# EAGLE design display2 (EAGLE 6.1)
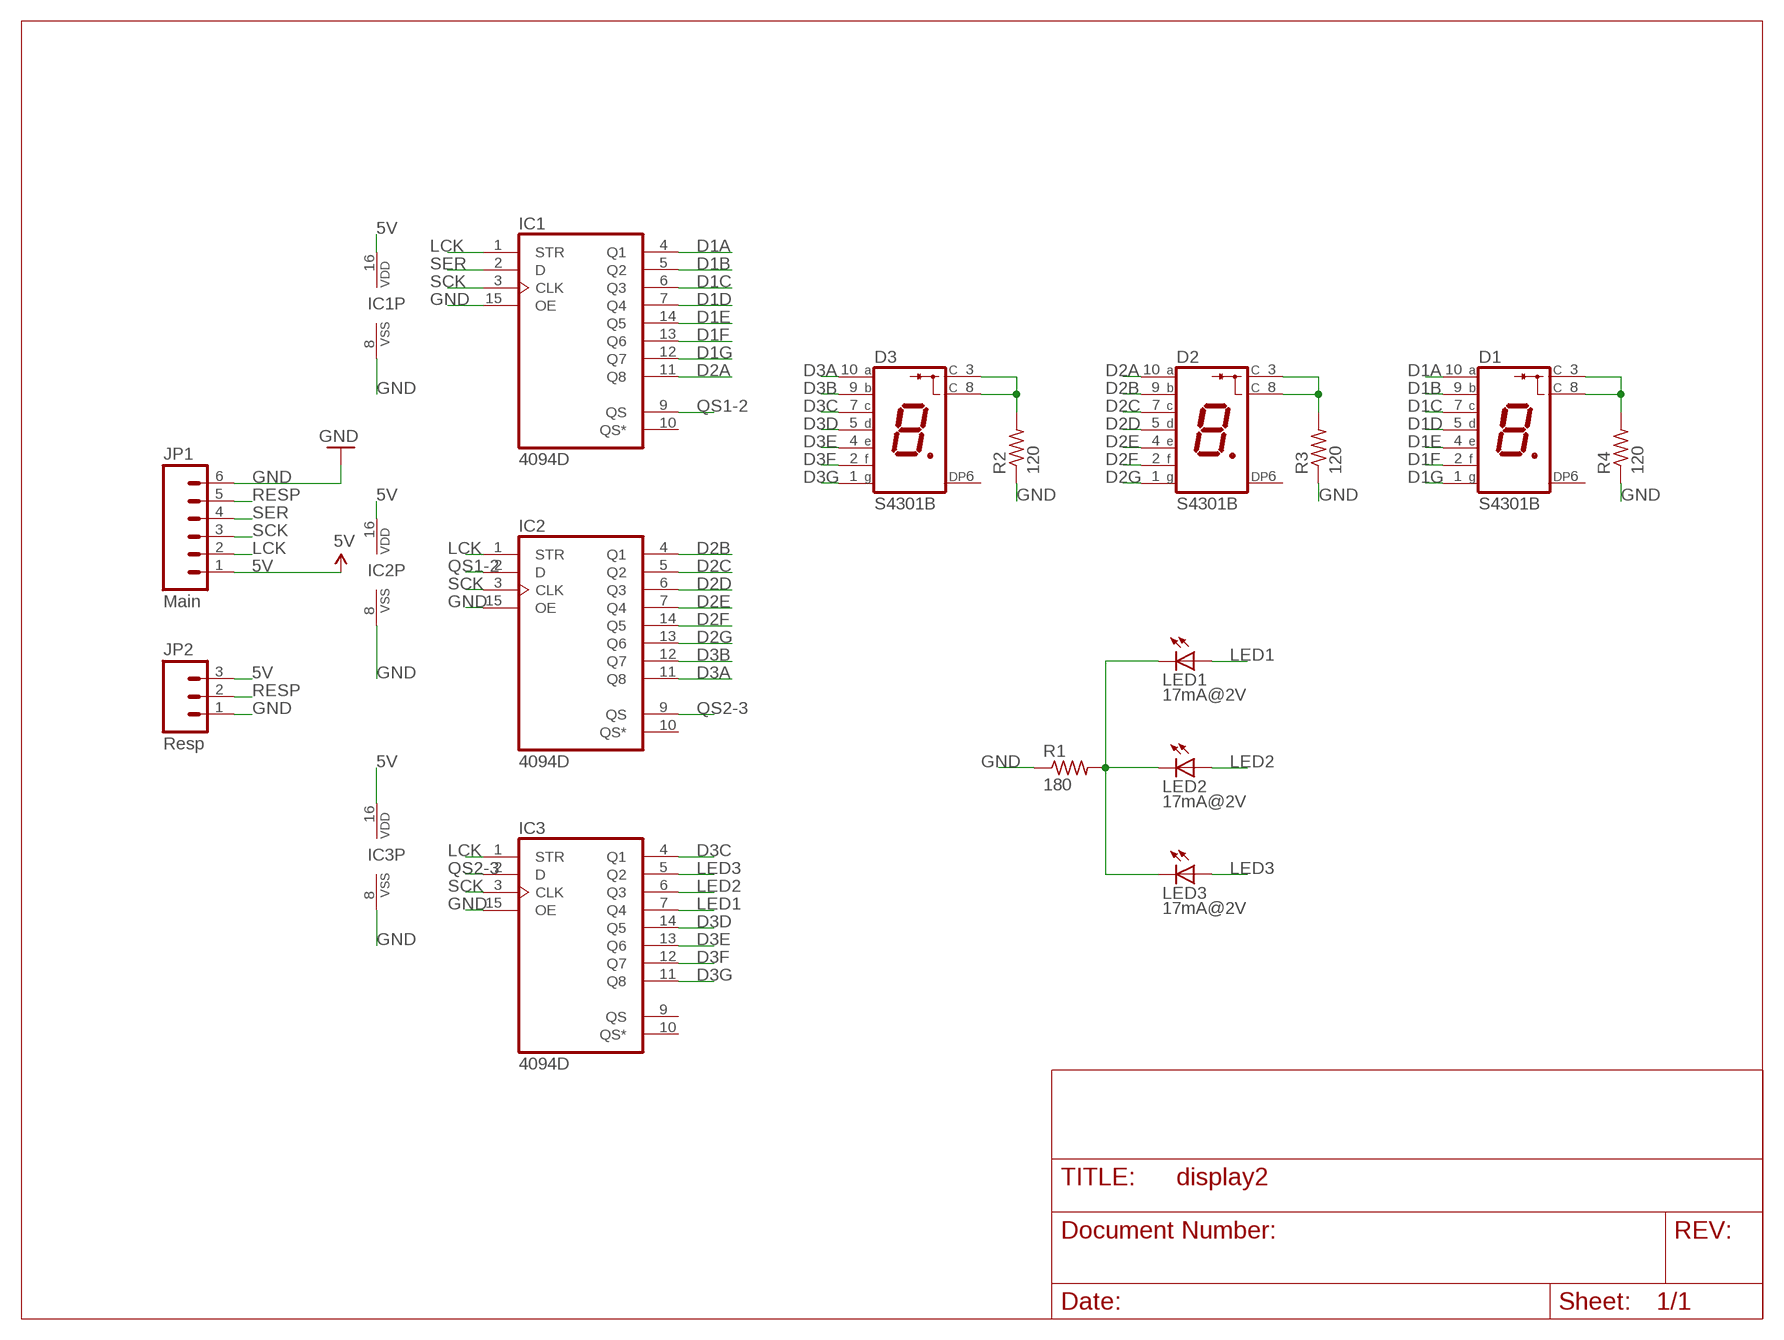
[diagram p0: schematic, sheet 1]

## Parts
D1  S4301B  [S4301B]
D2  S4301B  [S4301B]
D3  S4301B  [S4301B]
IC1  4094D  [SO16]
IC2  4094D  [SO16]
IC3  4094D  [SO16]
JP1  Main  M06SIP  [1X06]
JP2  Resp  M03PTH  [1X03]
LED1  17mA@2V  LED3MM  [LED3MM]
LED2  17mA@2V  LED3MM  [LED3MM]
LED3  17mA@2V  LED3MM  [LED3MM]
R1  180  R-US_0204/5  [0204/5]
R2  120  R-US_0204/5  [0204/5]
R3  120  R-US_0204/5  [0204/5]
R4  120  R-US_0204/5  [0204/5]

## Nets
5V: IC1.16(VDD) IC2.16(VDD) IC3.16(VDD) JP1.1 JP2.3
D1A: D1.10(A) IC1.4(Q1)
D1B: D1.9(B) IC1.5(Q2)
D1C: D1.7(C) IC1.6(Q3)
D1D: D1.5(D) IC1.7(Q4)
D1E: D1.4(E) IC1.14(Q5)
D1F: D1.2(F) IC1.13(Q6)
D1G: D1.1(G) IC1.12(Q7)
D2A: D2.10(A) IC1.11(Q8)
D2B: D2.9(B) IC2.4(Q1)
D2C: D2.7(C) IC2.5(Q2)
D2D: D2.5(D) IC2.6(Q3)
D2E: D2.4(E) IC2.7(Q4)
D2F: D2.2(F) IC2.14(Q5)
D2G: D2.1(G) IC2.13(Q6)
D3A: D3.10(A) IC2.11(Q8)
D3B: D3.9(B) IC2.12(Q7)
D3C: D3.7(C) IC3.4(Q1)
D3D: D3.5(D) IC3.14(Q5)
D3E: D3.4(E) IC3.13(Q6)
D3F: D3.2(F) IC3.12(Q7)
D3G: D3.1(G) IC3.11(Q8)
GND: IC1.8(VSS) IC1.15(OE) IC2.8(VSS) IC2.15(OE) IC3.8(VSS) IC3.15(OE) JP1.6 JP2.1 R1.1 R2.1 R3.1 R4.1
LCK: IC1.1(STR) IC2.1(STR) IC3.1(STR) JP1.2
LED1: IC3.7(Q4) LED1.A
LED2: IC3.6(Q3) LED2.A
LED3: IC3.5(Q2) LED3.A
N$1: LED1.K(C) LED2.K(C) LED3.K(C) R1.2
N$2: D3.3(C) D3.8(C) R2.2
N$3: D2.3(C) D2.8(C) R3.2
N$4: D1.3(C) D1.8(C) R4.2
QS1-2: IC1.9(QS) IC2.2(D)
QS2-3: IC2.9(QS) IC3.2(D)
RESP: JP1.5 JP2.2
SCK: IC1.3(CLK) IC2.3(CLK) IC3.3(CLK) JP1.3
SER: IC1.2(D) JP1.4
Unconnected: D1.6(DP) D2.6(DP) D3.6(DP) IC1.10(QS*) IC2.10(QS*) IC3.9(QS) IC3.10(QS*)

## Library data of the parts
D1-D3 = led-7-segment:S4301B: Single Digit Seven-Segment Display (cathode common) Source: LITEON .. S4301B.pdf; OC_FARNELL: unknown; OC_NEWARK: unknown
IC1-IC3 = 40xx:4094: 8-stage SHIFT/STORE REGISTER, tri-state
JP1 = SparkFun:M06: Header 6 Standard 6-pin 0.1" header. Use with straight break away headers (SKU : PRT-00116), right angle break away headers (PRT-00553), swiss pins (PRT-00743), machine pins (PRT-00117), and female headers (PRT-00115). Molex polarized connector foot print use with SKU : PRT-08094 with associated crimp pins and housings. NOTES ON THE VARIANTS LOCK and LOCK_LONGPADS... This footprint was designed to help hold the alignment of a through-hole component (i.e. 6-pin header) while soldering it into place. You may notice that each hole has been shifted either up or down by 0.005 of an inch from it's more standard position (which is a perfectly straight line). This slight alteration caused the pins (the squares in the middle) to touch the edges of the holes. Because they are alternating, it causes a "brace" to hold the component in place. 0.005 has proven to be the perfect amount of "off-center" position when using our standard breakaway headers. Although looks a little odd when you look at the bare footprint, once you have a header in there, the alteration is very hard to notice. Also, if you push a header all the way into place, it is covered up entirely on the bottom side. This idea of altering the position of holes to aid alignment will be further integrated into the Sparkfun Library for other footprints. It can help hold any component with 3 or more connection pins.
JP2 = SparkFun:M03: Header 3 Standard 3-pin 0.1" header. Use with straight break away headers (SKU : PRT-00116), right angle break away headers (PRT-00553), swiss pins (PRT-00743), machine pins (PRT-00117), and female headers (PRT-00115). Molex polarized connector foot print use with SKU : PRT-08232 with associated crimp pins and housings.
LED1-LED3 = SparkFun:LED: LEDs Standard schematic elements and footprints for 5mm, 3mm, 1206, and 0603 sized LEDs. 5mm - Spark Fun Electronics SKU : COM-00529 (and others)
R1-R4 = resistor:R-US_: RESISTOR, American symbol

## Board
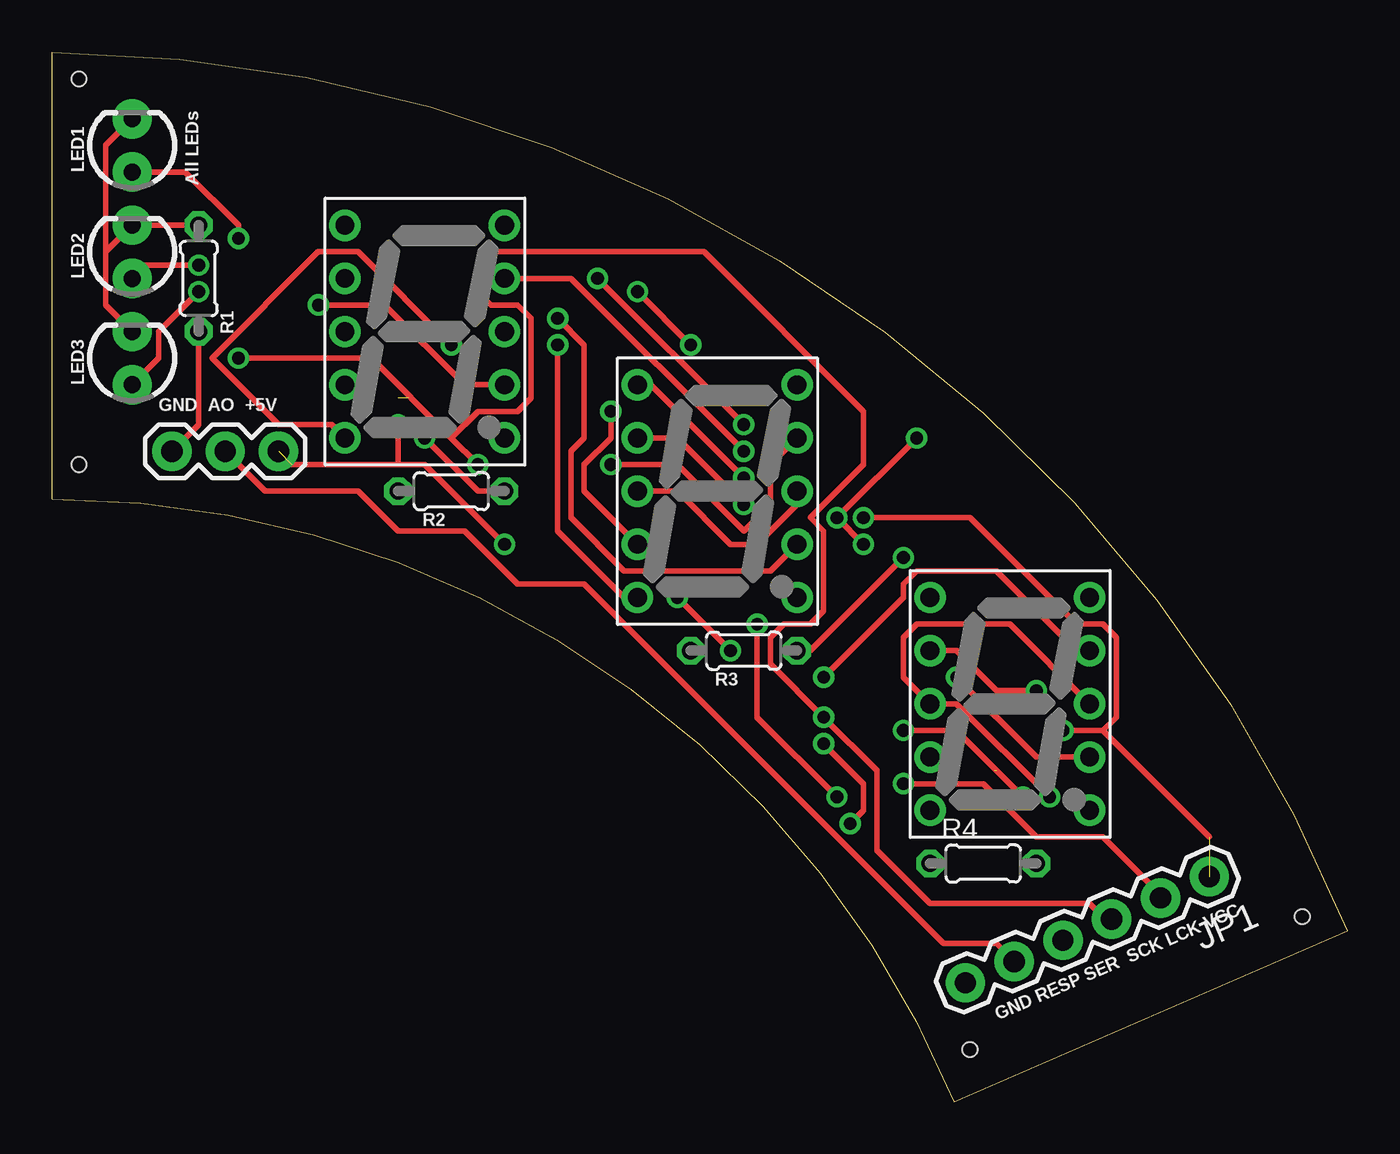
[diagram p1: board, top side]
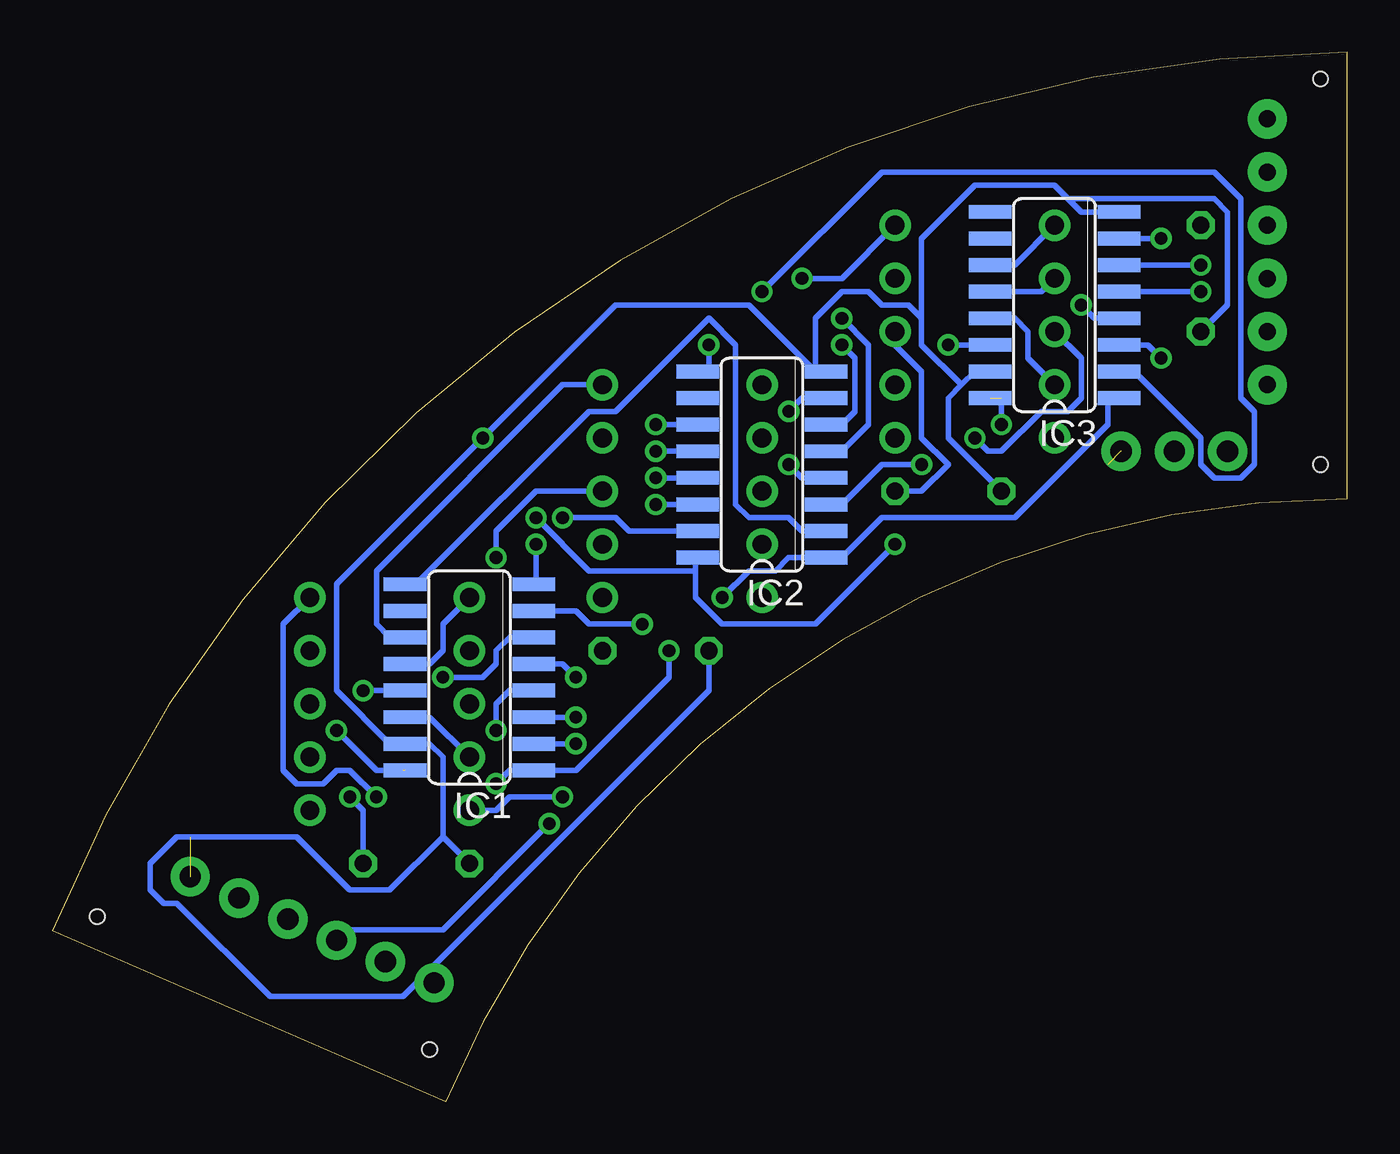
[diagram p2: board, bottom side, seen from below]

Size 61.83 x 50.11 mm. Coordinates in mm from the lower left corner, seen from the top.
Outline: 0,28.77 0,50.11 arc-68 61.83,8.16 43.05,0 arc68 0,28.77
Copper layers (1*16): Top 0.035mm / dielectric 1.5mm / Bottom 0.035mm
Design rules: minimum track width 10mil, minimum drill 24mil, track to track 8mil, track to pad 8mil, pad to pad 8mil, via to via 8mil, smd to smd 8mil, copper to edge 40mil, drill to drill 8mil, minimum pad ring 10mil, minimum via ring 8mil, stop-mask expansion 4mil, vias tented up to drill 25mil, thermal gap 10mil
Holes 0.7 mm at 1.27,48.84 1.27,30.42 59.69,8.83 43.81,2.48

### Footprints (pad centres in the part's own frame; a part is rotated, then mirrored left to right if it is on the bottom)
S4301B = drill 0.9 pad 1.5: 1 -3.81,5.08; 2 -3.81,2.54; 3 -3.81,0; 4 -3.81,-2.54; 5 -3.81,-5.08; 6 3.81,-5.08; 7 3.81,-2.54; 8 3.81,0; 9 3.81,2.54; 10 3.81,5.08
SO16 = smd 0.66 x 2.032: 1 -4.445,-3.073; 2 -3.175,-3.073; 3 -1.905,-3.073; 4 -0.635,-3.073; 5 0.635,-3.073; 6 1.905,-3.073; 7 3.175,-3.073; 8 4.445,-3.073; 9 4.445,3.073; 10 3.175,3.073; 11 1.905,3.073; 12 0.635,3.073; 13 -0.635,3.073; 14 -1.905,3.073; 15 -3.175,3.073; 16 -4.445,3.073
1X06 = drill 1.016 pad 1.88: 1 0,0; 2 2.54,0; 3 5.08,0; 4 7.62,0; 5 10.16,0; 6 12.7,0
1X03 = drill 1.016 pad 1.88: 1 0,0; 2 2.54,0; 3 5.08,0
LED3MM = drill 0.813 pad 1.88: A -1.27,0; K 1.27,0
0204/5 = drill 0.813 octagon: 1 -2.54,0; 2 2.54,0

### Placement (x,y rotation side)
D1  45.72,18.99 0 top
D2  31.75,29.15 0 top
D3  17.78,36.77 0 top
IC1  41.91,20.26 90 bottom
IC2  27.94,30.42 90 bottom
IC3  13.97,38.04 90 bottom
JP1  55.24,10.74 203.5 top
JP2  5.71,31.06 0 top
LED1  3.81,45.66 90 top
LED2  3.81,40.58 90 top
LED3  3.81,35.5 90 top
R1  6.99,39.31 90 top
R2  19.05,29.15 0 top
R3  33.02,21.53 0 top
R4  44.45,11.37 0 top

### Tracks (layer width: path | path; a pad name or v marks a point on that pad's centre or on a via)
5V  (via drill 0.61)  (4 unrouted)
  Top 0.254: 50.16,17.72 v48.26,17.72 | 55.24,12.64 50.16,17.72 | v21.59,26.61 17.78,30.42 16.51,30.42 | 11.43,30.42 16.51,30.42 | 16.51,30.42 v16.51,32.33 | 50.16,17.72 50.8,18.36 50.8,22.17 50.16,22.8 48.9,22.8 43.81,27.88 v38.73,27.88
  Bottom 0.254: 45.09,15.82 46.35,15.82 v48.26,17.72 | 31.11,25.34 31.11,24.07 29.84,22.8 25.4,22.8 v21.59,26.61 | 31.11,25.34 31.11,25.98 IC2.16 | v16.51,32.33 16.51,33.6 | v38.73,27.88 36.2,25.34 31.11,25.34
D1A  (via drill 0.61)
  Top 0.254: v40.64,17.72 43.18,17.72 v46.35,14.55
  Bottom 0.254: v40.64,17.72 40.64,18.99 40.01,19.63 39.37,19.63 IC1.4 | v46.35,14.55 47.62,15.82 48.26,15.82 48.9,15.18 50.16,15.18 50.8,15.82 50.8,22.8 D1.10
D1B  (via drill 0.61)
  Top 0.254: v36.83,20.26 40.64,24.07 40.64,24.71 41.27,25.34 45.09,25.34 48.9,21.53 D1.9
  Bottom 0.254: v36.83,20.26 37.47,20.9 38.73,20.9 IC1.5
D1C  (via drill 0.61)
  Top 0.254: v43.18,20.26 46.99,16.45 D1.7
  Bottom 0.254: v43.18,20.26 41.27,20.26 40.64,20.9 40.64,21.53 40.01,22.17 39.37,22.17 IC1.6
D1D  (via drill 0.61)
  Top 0.254: v33.66,22.8 33.66,18.36 v37.47,14.55
  Bottom 0.254: v33.66,22.8 36.2,22.8 36.83,23.44 38.73,23.44 IC1.7 | v37.47,14.55 40.01,14.55 40.64,13.91 D1.5
D1E
  Bottom 0.254: D1.4 43.81,18.36 44.45,18.36 IC1.14
D1F  (via drill 0.61)
  Top 0.254: v46.99,19.63 45.09,19.63 43.18,21.53 D1.2
  Bottom 0.254: v46.99,19.63 45.09,19.63 IC1.13
D1G
  Bottom 0.254: D1.1 43.18,22.8 43.18,21.53 43.81,20.9 44.45,20.9 IC1.12
D2A
  Bottom 0.254: D2.10 37.47,34.23 46.35,25.34 46.35,22.8 45.72,22.17 45.09,22.17 IC1.11
D2B  (via drill 0.61)
  Top 0.254: v26.67,30.42 29.84,30.42 33.02,27.25 34.29,28.52 34.29,30.42 D2.9
  Bottom 0.254: v26.67,30.42 26.04,29.79 25.4,29.79 IC2.4
D2C  (via drill 0.61)
  Top 0.254: v24.13,37.41 25.4,36.14 25.4,31.69 24.77,31.06 24.77,27.88 27.3,25.34 34.29,25.34 D2.7
  Bottom 0.254: v24.13,37.41 22.86,36.14 22.86,32.33 24.13,31.06 24.77,31.06 IC2.5
D2D  (via drill 0.61)
  Top 0.254: v24.13,36.14 24.13,27.25 27.3,24.07 D2.5
  Bottom 0.254: v24.13,36.14 23.5,35.5 23.5,32.96 24.13,32.33 24.77,32.33 IC2.6
D2E  (via drill 0.61)
  Top 0.254: v26.67,32.96 26.67,31.69 25.4,30.42 25.4,29.15 D2.4
  Bottom 0.254: v26.67,32.96 26.04,33.6 25.4,33.6 IC2.7
D2F  (via drill 0.61)
  Top 0.254: v33.02,28.52 29.84,31.69 D2.2
  Bottom 0.254: v33.02,28.52 31.11,28.52 IC2.14
D2G  (via drill 0.61)
  Top 0.254: v33.02,29.79 28.57,34.23 D2.1
  Bottom 0.254: v33.02,29.79 31.11,29.79 IC2.13
D3A  (via drill 0.61)
  Top 0.254: v26.04,39.31 v33.02,32.33
  Bottom 0.254: v33.02,32.33 31.11,32.33 IC2.11 | v26.04,39.31 24.13,39.31 D3.10
D3B  (via drill 0.61)
  Top 0.254: v33.02,31.06 24.77,39.31 D3.9
  Bottom 0.254: v33.02,31.06 31.11,31.06 IC2.12
D3C  (via drill 0.61)
  Top 0.254: v12.7,38.04 15.88,38.04 19.68,34.23 D3.7
  Bottom 0.254: v12.7,38.04 12.06,37.41 11.43,37.41 IC3.4
D3D  (via drill 0.61)
  Top 0.254: v19.05,36.14 14.61,40.58 12.7,40.58 7.62,35.5 10.79,32.33 13.34,32.33 D3.5
  Bottom 0.254: v19.05,36.14 17.14,36.14 IC3.14
D3E
  Bottom 0.254: D3.4 15.24,35.5 15.24,36.77 15.88,37.41 16.51,37.41 IC3.13
D3F
  Bottom 0.254: D3.2 14.61,38.68 16.51,38.68 IC3.12
D3G
  Bottom 0.254: D3.1 15.88,39.95 16.51,39.95 IC3.11
GND  (via drill 0.61)
  Top 0.254: R1.1 6.99,32.33 JP2.1 | v38.73,26.61 v37.47,27.88 v41.27,31.69
  Bottom 0.254: R3.1 30.48,19.63 43.81,6.29 JP1.6 43.81,5.66 44.45,5.66 45.09,5.02 51.44,5.02 55.88,9.47 56.52,9.47 57.15,10.1 57.15,11.37 55.88,12.64 50.16,12.64 47.62,10.1 45.72,10.1 43.18,12.64 | v37.47,27.88 34.92,27.88 34.29,27.25 31.11,27.25 IC2.15 | v38.73,26.61 38.73,24.71 IC1.8 | 43.18,12.64 43.18,16.45 43.81,17.09 44.45,17.09 IC1.15 45.09,17.09 45.72,17.09 48.26,19.63 48.26,24.71 v41.27,31.69 34.92,38.04 28.57,38.04 25.4,34.87 | R4.1 43.18,12.64 | 18.41,34.23 19.05,33.6 19.05,31.69 R2.1 | 18.41,34.23 17.78,34.87 17.14,34.87 IC3.15 | 25.4,34.87 25.4,37.41 24.13,38.68 22.86,38.68 22.23,38.04 20.95,38.04 20.32,37.41 | 20.32,37.41 20.32,36.14 18.41,34.23 | 25.4,34.87 IC2.8 25.4,34.87 | 13.34,43.12 13.97,43.76 17.78,43.76 20.32,41.22 20.32,37.41 | 13.34,43.12 12.7,42.49 11.43,42.49 IC3.8 | R1.1 5.71,38.04 5.71,42.49 6.35,43.12 13.34,43.12
LCK  (via drill 0.61)
  Top 0.254: v40.64,15.18 44.45,15.18 46.99,12.64 50.16,12.64 52.7,10.1 JP1.2 | v32.38,21.53 v29.84,24.07
  Bottom 0.254: IC3.1 11.43,33.6 11.43,32.33 15.88,27.88 22.23,27.88 24.13,25.98 24.77,25.98 IC2.1 25.4,25.98 26.67,25.98 27.3,25.34 28.57,25.34 v29.84,24.07 | v40.64,15.18 40.01,15.82 39.37,15.82 IC1.1 38.73,15.82 36.83,15.82 32.38,20.26 v32.38,21.53
LED1  (via drill 0.61)
  Top 0.254: v8.89,41.22 8.89,41.85 6.35,44.39 LED1.A
  Bottom 0.254: v8.89,41.22 10.79,41.22 IC3.7
LED2  (via drill 0.61)
  Top 0.254: v6.99,39.95 4.45,39.95 LED2.A
  Bottom 0.254: v6.99,39.95 10.79,39.95 IC3.6
LED3  (via drill 0.61)
  Top 0.254: v6.99,38.68 5.08,36.77 5.08,35.5 LED3.A
  Bottom 0.254: v6.99,38.68 10.79,38.68 IC3.5
N$1
  Top 0.254: R1.2 LED2.K 2.54,40.58 | LED3.K 2.54,38.04 2.54,40.58 | LED1.K 2.54,45.66 2.54,40.58
N$2  (via drill 0.61)
  Top 0.254: v17.78,31.69 20.32,29.15 R2.2
  Bottom 0.254: R2.2 20.32,29.15 19.05,30.42 20.32,31.69 20.32,34.87 21.59,36.14 D3.8 | D3.3 12.7,35.5 12.7,33.6 13.34,32.96 14.61,32.96 16.51,31.06 17.14,31.06 v17.78,31.69
N$3  (via drill 0.61)
  Top 0.254: R3.2 36.2,21.53 v40.64,25.98 | D2.3 29.84,29.15 32.38,26.61 33.66,26.61 35.56,28.52 D2.8
  Bottom 0.254: v40.64,25.98 40.64,27.25 38.73,29.15 D2.8
N$4  (via drill 0.61)
  Top 0.254: v47.62,14.55 43.18,18.99 D1.3 40.64,20.26 40.64,22.17 41.27,22.8 45.72,22.8 D1.8
  Bottom 0.254: R4.2 46.99,13.91 v47.62,14.55
QS1-2
  Bottom 0.254: IC1.9 44.45,24.71 36.2,32.96 34.92,32.96 30.48,37.41 29.21,36.14 29.21,28.52 28.57,27.88 26.67,27.88 26.04,27.25 25.4,27.25 IC2.2
QS2-3  (via drill 0.61)
  Top 0.254: v30.48,36.14 v27.94,38.68
  Bottom 0.254: v27.94,38.68 22.23,44.39 6.35,44.39 5.08,43.12 5.08,33.6 4.45,32.96 4.45,30.42 5.08,29.79 6.35,29.79 6.99,30.42 6.99,31.69 10.16,34.87 10.79,34.87 IC3.2 | v30.48,36.14 30.48,34.87 IC2.9
RESP
  Top 0.254: JP2.2 10.16,29.15 14.61,29.15 16.51,27.25 19.68,27.25 22.23,24.71 25.4,24.71 42.55,7.56 45.09,7.56 45.72,6.93 JP1.5
SCK  (via drill 0.61)
  Top 0.254: v8.89,35.5 15.24,35.5 19.05,31.69 | v20.32,30.42 19.05,31.69 | JP1.3 50.16,8.83 49.53,9.47 41.91,9.47 39.37,12.01 39.37,15.82 v36.83,18.36 34.29,20.9 34.29,22.17 34.92,22.8 36.2,22.8 36.83,23.44 36.83,27.25 36.2,27.88 38.73,30.42 38.73,32.96 31.11,40.58 20.95,40.58 20.32,39.95 20.32,38.68 20.95,38.04 22.23,38.04 22.86,37.41 22.86,33.6 22.23,32.96 20.32,32.96 19.05,31.69
  Bottom 0.254: v8.89,35.5 9.53,36.14 10.79,36.14 IC3.3 | v20.32,30.42 22.23,30.42 24.13,28.52 24.77,28.52 IC2.3 | v36.83,18.36 38.73,18.36 IC1.3
SER  (via drill 0.61)
  Top 0.254: v36.83,17.09 38.73,15.18 38.73,13.91 v38.1,13.28
  Bottom 0.254: v36.83,17.09 38.73,17.09 IC1.2 | v38.1,13.28 43.18,8.2 47.62,8.2 JP1.4

### Text on the board
tNames: All LEDs | GND AO +5V | GND RESP SER SCK LCK VCC